# Altium schematic sheet Ethernet_Rev.SchDoc
size A4
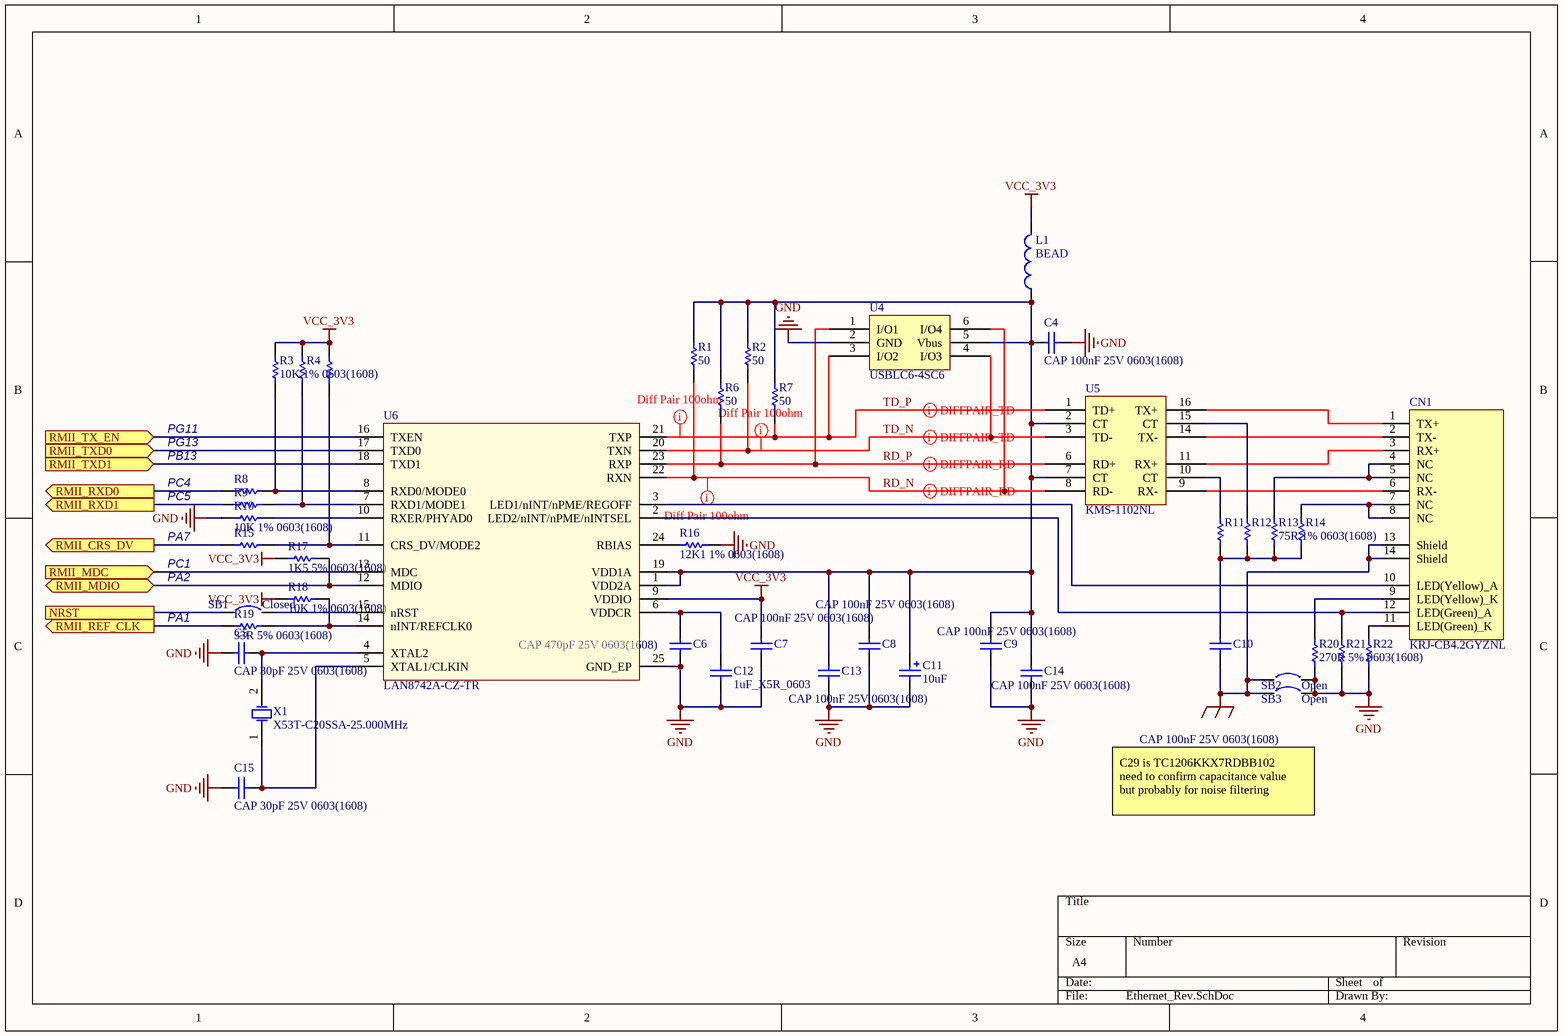
[diagram p0: Ethernet_Rev.SchDoc]

## Parts
C4  CAP 100nF 25V 0603(1608)  [CAPC0603(1608)100_N]
C5  CAP 30pF 25V 0603(1608)  [CAPC0603(1608)100_N]
C6  CAP 470pF 25V 0603(1608)  [CAPC0603(1608)100_M]
C7  CAP 100nF 25V 0603(1608)  [CAPC0603(1608)100_N]
C8  CAP 100nF 25V 0603(1608)  [CAPC0603(1608)100_N]
C9  CAP 100nF 25V 0603(1608)  [CAPC0603(1608)100_N]
C10  CAP 100nF 25V 0603(1608)  [CAPC0603(1608)100_N]
C11  10uF  [TAN-A]
C12  1uF_X5R_0603  [0603C]
C13  CAP 100nF 25V 0603(1608)  [CAPC0603(1608)100_N]
C14  CAP 100nF 25V 0603(1608)  [CAPC0603(1608)100_N]
C15  CAP 30pF 25V 0603(1608)  [CAPC0603(1608)100_N]
CN1  KRJ-CB4.2GYZNL  [RJ45_KRJ-CB4.2GYZNL]
L1  BEAD  [0603L]
R1  50  [0603R]
R2  50  [0603R]
R3  10K 1% 0603(1608)  [RESC0603(1608)_N]
R4  10K 1% 0603(1608)  [RESC0603(1608)_N]  (value not drawn)
R5  10K 1% 0603(1608)  [RESC0603(1608)_N]  (value not drawn)
R6  50  [0603R]
R7  50  [0603R]
R8  33R 5% 0603(1608)  [RESC0603(1608)_M]  (value not drawn)
R9  33R 5% 0603(1608)  [RESC0603(1608)_M]  (value not drawn)
R10  10K 1% 0603(1608)  [RESC0603(1608)_N]
R11  75R 1% 0603(1608)  [RESC0603(1608)_M]  (value not drawn)
R12  75R 1% 0603(1608)  [RESC0603(1608)_M]  (value not drawn)
R13  75R 1% 0603(1608)  [RESC0603(1608)_M]
R14  75R 1% 0603(1608)  [RESC0603(1608)_M]  (value not drawn)
R15  33R 5% 0603(1608)  [RESC0603(1608)_M]  (value not drawn)
R16  12K1 1% 0603(1608)  [RESC0603(1608)_M]
R17  1K5 5% 0603(1608)  [RESC0603(1608)_M]
R18  10K 1% 0603(1608)  [RESC0603(1608)_N]
R19  33R 5% 0603(1608)  [RESC0603(1608)_M]
R20  270R 5% 0603(1608)  [RESC0603(1608)_N]
R21  270R 5% 0603(1608)  [RESC0603(1608)_N]  (value not drawn)
R22  270R 5% 0603(1608)  [RESC0603(1608)_N]  (value not drawn)
SB1  Closed  [SB_0603]
SB2  Open  [SB_0603]
SB3  Open  [SB_0603]
U4  USBLC6-4SC6  [SOT23-6L]
U5  KMS-1102NL  [Transformer]
U6  LAN8742A-CZ-TR  [QFN24_0R5_4X4]
X1  X53T-C20SSA-25.000MHz  [XTAL_2SM_5R0X3R2]

## Ports
NRST, RMII_CRS_DV (out), RMII_MDC (in), RMII_MDIO (bidir), RMII_REF_CLK (out), RMII_RXD0 (out), RMII_RXD1 (out), RMII_TX_EN (in), RMII_TXD0 (in), RMII_TXD1 (in)

## Nets
EGND: C10.1 CN1.13(Shield) CN1.14(Shield) SB2.1 SB3.1
GND: C4.2 C5.1 C6.1 C7.1 C8.1 C9.1 C11.2 C12.2 C13.1 C14.1 C15.1 R10.1 R16.2 R20.1 R21.1 R22.1 SB2.2 SB3.2 U4.2(GND) U6.25(GND_EP)
VCC_3V3: C7.2 L1.2 R3.2 R4.2 R5.2 R17.1 R18.1 U6.9(VDDIO)
NRST: SB1.1 ; port NRST
RD_N: R1.1 U4.6(I/O4) U5.8(RD-) U6.22(RXN)
RD_P: R6.1 U4.1(I/O1) U5.6(RD+) U6.23(RXP)
RMII_CRS_DV: R15.1 ; port RMII_CRS_DV
RMII_MDC: U6.13(MDC) ; port RMII_MDC
RMII_MDIO: R17.2 U6.12(MDIO) ; port RMII_MDIO
RMII_REF_CLK: R19.1 ; port RMII_REF_CLK
RMII_RXD0: R8.1 ; port RMII_RXD0
RMII_RXD1: R9.1 ; port RMII_RXD1
RMII_TX_EN: U6.16(TXEN) ; port RMII_TX_EN
RMII_TXD0: U6.17(TXD0) ; port RMII_TXD0
RMII_TXD1: U6.18(TXD1) ; port RMII_TXD1
TD_N: R2.1 U4.4(I/O3) U5.3(TD-) U6.20(TXN)
TD_P: R7.1 U4.3(I/O2) U5.1(TD+) U6.21(TXP)
NetC4_1: C4.1 C8.2 C9.2 C11.1 C13.2 C14.2 L1.1 R1.2 R2.2 R6.2 R7.2 U4.5(Vbus) U5.2(CT) U5.7(CT) U6.1(VDD2A) U6.19(VDD1A)
NetC5_2: C5.2 U6.4(XTAL2) X1.2(OSC2)
NetC6_2: C6.2 C12.1 U6.6(VDDCR)
NetC10_2: C10.2 R11.1 R12.1 R13.1 R14.1
NetC15_2: C15.2 U6.5(XTAL1/CLKIN) X1.1(OSC1)
NetCN1_1: CN1.1(TX+) U5.16(TX+)
NetCN1_2: CN1.2(TX-) U5.14(TX-)
NetCN1_3: CN1.3(RX+) U5.11(RX+)
NetCN1_4: CN1.4(NC) CN1.5(NC) R13.2
NetCN1_6: CN1.6(RX-) U5.9(RX-)
NetCN1_7: CN1.7(NC) CN1.8(NC) R14.2
NetCN1_9: CN1.9(LED(Yellow)_K) R20.2
NetCN1_10: CN1.10(LED(Yellow)_A) U6.3(LED1/nINT/nPME/REGOFF)
NetCN1_11: CN1.11(LED(Green)_K) R22.2
NetCN1_12: CN1.12(LED(Green)_A) R21.2 U6.2(LED2/nINT/nPME/nINTSEL)
NetR3_1: R3.1 R8.2 U6.8(RXD0/MODE0)
NetR4_1: R4.1 R9.2 U6.7(RXD1/MODE1)
NetR5_1: R5.1 R15.2 U6.11(CRS_DV/MODE2)
NetR10_2: R10.2 U6.10(RXER/PHYAD0)
NetR11_2: R11.2 U5.10(CT)
NetR12_2: R12.2 U5.15(CT)
NetR16_1: R16.1 U6.24(RBIAS)
NetR18_2: R18.2 R19.2 U6.14(nINT/REFCLK0)
NetSB1_2: SB1.2 U6.15(nRST)

## Layout directives
differential pair: RD_N, RD_P, TD_N, TD_P
rule Matched Net Lengths [Tolerance = 100mil]: RD_N, TD_N, TD_P

## Notes on the sheet
- PG11
- PG13
- PB13
- PC4
- PC5
- PA7
- PC1
- PA2
- PA1
- C29 is TC1206KKX7RDBB102
  need to confirm capacitance value
  but probably for noise filtering

## Library data of the parts
C4 C7-C10 C13 C14 = CMP-1035-02587-1: CAP 100nF 25V ±5% 0603 (1608 Metric) Thickness 1mm SMD; Case-EIA: 0603; Tolerance: Â±5%; Case-Metric: 1608; Technology: SMT; Max Thickness: 1 mm; Rated Voltage: 25 V; Value: 100nF
C5 C15 = CMP-1035-00910-1: CAP 30pF 25V ±5% 0603 (1608 Metric) Thickness 1mm SMD; Case-EIA: 0603; Tolerance: Â±5%; Case-Metric: 1608; Max Thickness: 1 mm; Technology: SMT; Value: 30pF; Rated Voltage: 25 V
C6 = CMP-1035-01670-1: CAP 470pF 25V ±5% 0603 (1608 Metric) Thickness 1mm SMD; Tolerance: Â±5%; Case-Metric: 1608; Case-EIA: 0603; Rated Voltage: 25 V; Value: 470pF; Max Thickness: 1 mm; Technology: SMT
C11 = Cap_10uF_POL_10%_TANA: Polarized Capacitor,10uF,10V,10%,typeA,VISHAY; Manuf_Part_1: 293D106X9010A2TE3; Revision: July-2002: Re-released for DXP Platform.; Value: 10uF; Manuf_1: VISHAY; Order: *; ECCN_US/EU: n/a
C12 = CAP SMD 0603  X5R 1µF 25V 10%: 0603  X5R 1µF; Rated voltage: 25V; Tolerance: 10%; Manufacturer: *; Manufacturer P/N: *; Order code Farnell: 1288202RL; Value: 1µF; Power: *; Technology: X5R; Temperature  Factor: *; Temperature Max: +125°C; Temperature Min: -55°C; STS Code: *
CN1 = KRJ-CB4.2GYZNL: 100 Base-TX (Fast Ethernet) SMD RJ45 single port (1x1) with LEDS Integrated Magnetics Connector; Manuf_1: HanRun; Manuf_Part_1: HR961160C; Manuf_2: Pulse Electronics Corporation; Manuf_Part_2: J3011G21DNLT; Manuf_3: K.O.D International Holding; Manuf_Part_3: RMT-119A-12F6-GY-04; Distrib: Sub Co; Order: *
L1 = Inductor: Value: 100uH; Published: 8-Jun-2000; Revision: July-2002: Re-released for DXP Platform.; Publisher: Altium Limited
R1 R2 R6 R7 = Res_50_1%_0603: Resistor,50,0603,1%,YAGEO; Manuf_Part_1: RC0402FR-0750RL; Value: 50; Manuf_1: YAGEO; Order: *; ECCN_US/EU: n/a; Distrib: FARNELL
R3-R5 R10 R18 = CMP-1012-00623-1: 10K 0.1W 1% 0603 (1608 Metric)  SMD; Value: 10000.00 Ohm; Case-EIA: 0603; Case-Metric: 1608; Power: 0.1 W; Tolerance: 1 %; Technology: SMT
R8 R9 R15 R19 = CMP-1012-00038-1: 33R 0.1W 5% 0603 (1608 Metric)  SMD; Value: 33.00 Ohm; Case-EIA: 0603; Case-Metric: 1608; Tolerance: 5 %; Technology: SMT; Power: 0.1 W
R11-R14 = CMP-1012-00383-1: 75R 0.1W 1% 0603 (1608 Metric)  SMD; Case-EIA: 0603; Value: 75.00 Ohm; Case-Metric: 1608; Power: 0.1 W; Technology: SMT; Tolerance: 1 %
R16 = CMP-1012-00632-1: 12K1 0.1W 1% 0603 (1608 Metric)  SMD; Case-Metric: 1608; Case-EIA: 0603; Value: 12100.00 Ohm; Power: 0.1 W; Technology: SMT; Tolerance: 1 %
R17 = CMP-1012-00078-1: 1K5 0.1W 5% 0603 (1608 Metric)  SMD; Case-Metric: 1608; Case-EIA: 0603; Value: 1500.00 Ohm; Technology: SMT; Power: 0.1 W; Tolerance: 5 %
R20-R22 = CMP-1012-00060-1: 270R 0.1W 5% 0603 (1608 Metric)  SMD; Case-Metric: 1608; Case-EIA: 0603; Value: 270.00 Ohm; Power: 0.1 W; Tolerance: 5 %; Technology: SMT
SB1 = Circuit Breaker_close: Circuit Breaker; Published: 24-Mar-1999; Revision: July-2002: Re-released for DXP Platform.; Publisher: Altium Limited
SB2 SB3 = Circuit Breaker: Published: 24-Mar-1999; Revision: July-2002: Re-released for DXP Platform.; Publisher: Altium Limited
U6 = LAN8742A-CZ-TR: LAN8742A-CZ-TR - Small Footprint RMII 10/100 Ethernet, Transceiver with HP Auto-MDIX and flexPWR Technology SQFN-24; Manuf_1: MICROCHIP; Order: LAN8742A-CZ-TR; Manuf_Part_1: LAN8742A-CZ-TR; Distrib: MICROCHIP
X1 = XTAL_5032: Crystal Oscillator; Published: 8-Jun-2000; LatestRevisionDate: 17-Jul-2002; LatestRevisionNote: Re-released for DXP Platform.; PackageReference: R38; Publisher: Altium Limited